# Altium schematic sheet Power Management.SchDoc
size A4; SheetNumber: 2; SheetTotal: 7
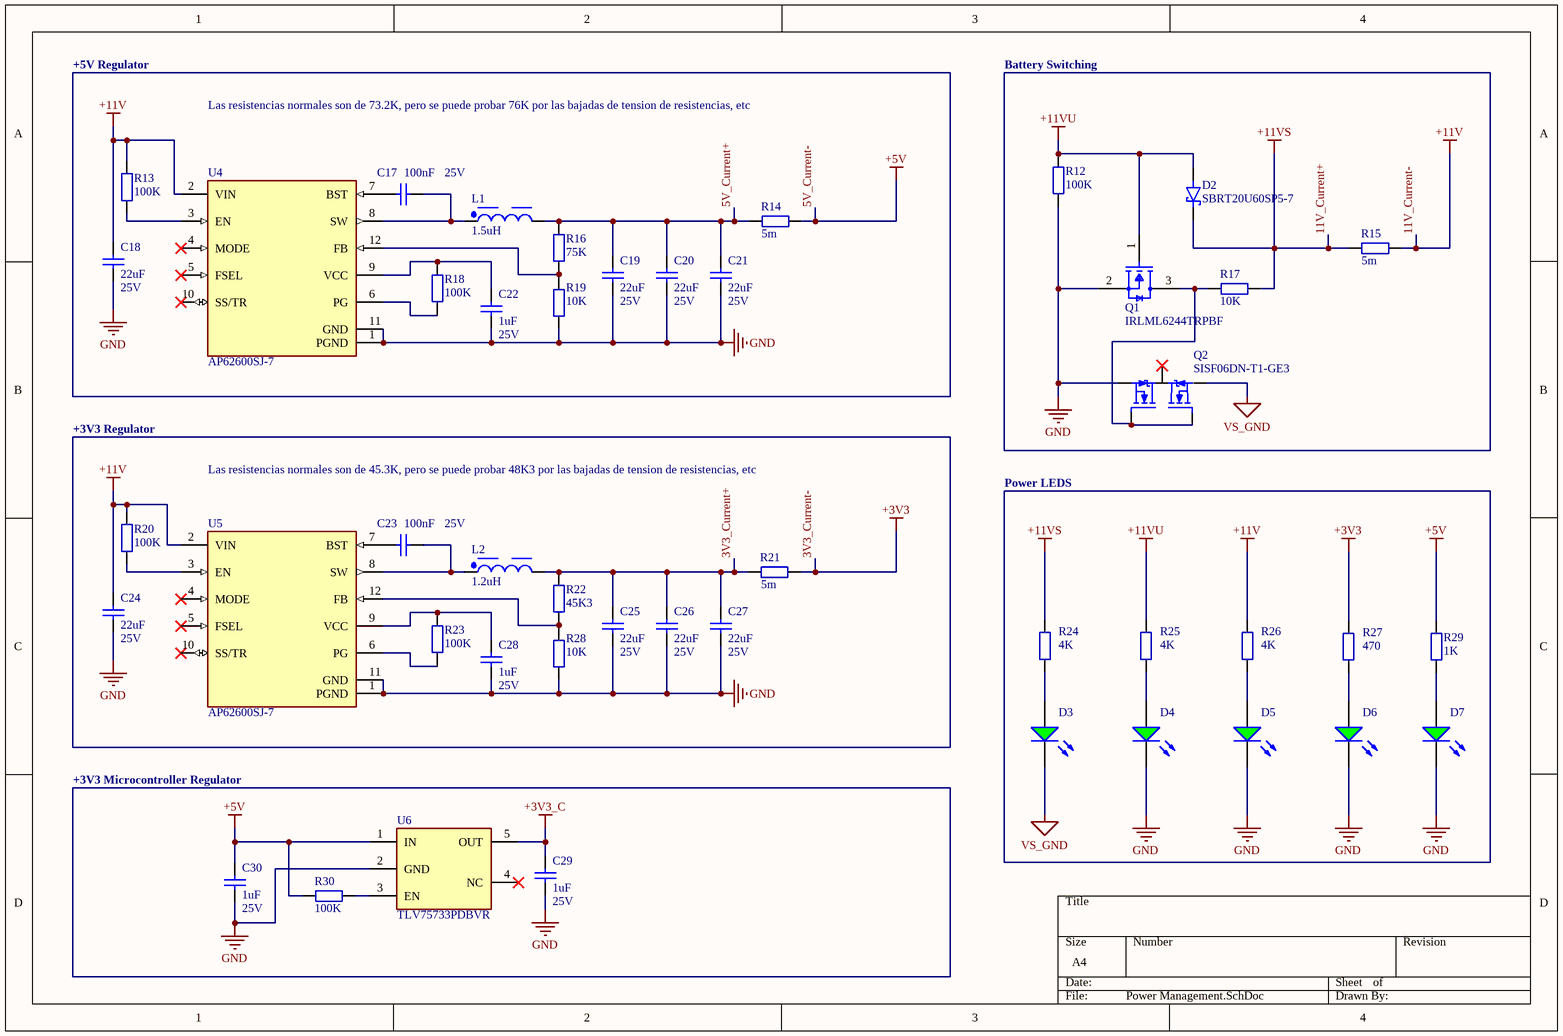
[diagram p0: Power Management.SchDoc]

## Parts
C17  value 100nF  Voltage: 25V  [MY_0603]  (hidden comment: Cap ceramic)
C18  22uF  Voltage: 25V  [MY_0805]
C19  22uF  Voltage: 25V  [MY_0805]
C20  22uF  Voltage: 25V  [MY_0805]
C21  22uF  Voltage: 25V  [MY_0805]
C22  value 1uF  Volte: 25V  [MY_0603]  (hidden comment: Cap ceramic)
C23  value 100nF  Voltage: 25V  [MY_0603]  (hidden comment: Cap ceramic)
C24  22uF  Voltage: 25V  [MY_0805]
C25  22uF  Voltage: 25V  [MY_0805]
C26  22uF  Voltage: 25V  [MY_0805]
C27  22uF  Voltage: 25V  [MY_0805]
C28  value 1uF  Volte: 25V  [MY_0603]  (hidden comment: Cap ceramic)
C29  value 1uF  Volte: 25V  [MY_0603]  (hidden comment: Cap ceramic)
C30  value 1uF  Volte: 25V  [MY_0603]  (hidden comment: Cap ceramic)
D2  SBRT20U60SP5-7  [SBRT20U60SP5-7-Footprint-1]
D3  (no value)  [WL-SMCW_0805_150080xx75000]
D4  (no value)  [WL-SMCW_0805_150080xx75000]
D5  (no value)  [WL-SMCW_0805_150080xx75000]
D6  (no value)  [WL-SMCW_0805_150080xx75000]
D7  (no value)  [WL-SMCW_0805_150080xx75000]
L1  1.5uH  [WE-MAPI_4020]
L2  1.2uH  [WE-MAPI_4020]
Q1  IRLML6244TRPBF  [FP-Micro3-IPC_C]
Q2  SISF06DN-T1-GE3  [SISF06DN-T1-GE3-Footprint-1]
R12  100K  [R0603-0.45]
R13  100K  [R0603-0.45]
R14  5m  [R0612]
R15  5m  [R0612]
R16  75K  [R0603-0.45]
R17  10K  [R0603-0.45]
R18  100K  [R0603-0.45]
R19  10K  [R0603-0.45]
R20  100K  [R0603-0.45]
R21  5m  [R0612]
R22  45K3  [R0603-0.45]
R23  100K  [R0603-0.45]
R24  4K  [R0603-0.45]
R25  4K  [R0603-0.45]
R26  4K  [R0603-0.45]
R27  470  [R0603-0.45]
R28  10K  [R0603-0.45]
R29  1K  [R0603-0.45]
R30  100K  [R0603-0.45]
U4  AP62600SJ-7  [FP-V-QFN2030-12_Type_A-MFG]
U5  AP62600SJ-7  [FP-V-QFN2030-12_Type_A-MFG]
U6  TLV75733PDBVR  [SOT95P280X145-5N]

## Blocks framed on the sheet
+5V Regulator: C17-C22 L1 R13 R14 R16 R18 R19 U4
Battery Switching: D2 Q1 Q2 R12 R15 R17
+3V3 Regulator: C23-C28 L2 R20-R23 R28 U5
Power LEDS: D3-D7 R24-R27 R29
+3V3 Microcontroller Regulator: C29 C30 R30 U6

## Nets
3V3_Current-: R21.2 R27.2  [also labelled +3V3]
5V_Current-: C30.2 R14.2 R29.2 R30.1 U6.1(IN)  [also labelled +5V]
11V_Current+: D2.2 R15.1 R17.2 R24.2  [also labelled +11VS]
11V_Current-: C18.1 C24.1 R13.1 R15.2 R20.1 R26.2 U4.2(VIN) U5.2(VIN)  [also labelled +11V]
+3V3_C: C29.2 U6.5(OUT)
+11VU: D2.1 Q1.1(G) R12.1 R25.2
GND: C18.2 C19.2 C20.2 C21.2 C22.1 C24.2 C25.2 C26.2 C27.2 C28.1 C29.1 C30.1 D4.1(K) D5.1(K) D6.1(K) D7.1(K) Q1.2(S) Q2.4(S1) R12.2 R19.2 R28.2 U4.1(PGND) U4.11(GND) U5.1(PGND) U5.11(GND) U6.2(GND)
VS_GND: D3.1(K) Q2.5(S2)
3V3_Current+: C25.1 C26.1 C27.1 L2.2 R21.1 R22.1
5V_Current+: C19.1 C20.1 C21.1 L1.2 R14.1 R16.1
NetC17_1: C17.1 L1.1 U4.8(SW)
NetC17_2: C17.2 U4.7(BST)
NetC22_2: C22.2 R18.1 U4.9(VCC)
NetC23_1: C23.1 L2.1 U5.8(SW)
NetC23_2: C23.2 U5.7(BST)
NetC28_2: C28.2 R23.1 U5.9(VCC)
NetD3_2: D3.2(A) R24.1
NetD4_2: D4.2(A) R25.1
NetD5_2: D5.2(A) R26.1
NetD6_2: D6.2(A) R27.1
NetD7_2: D7.2(A) R29.1
NetQ1_3: Q1.3(D) Q2.1(G1) Q2.3(G2) R17.1
NetR13_2: R13.2 U4.3(EN)
NetR16_2: R16.2 R19.1 U4.12(FB)
NetR18_2: R18.2 U4.6(PG)
NetR20_2: R20.2 U5.3(EN)
NetR22_2: R22.2 R28.1 U5.12(FB)
NetR23_2: R23.2 U5.6(PG)
NetR30_2: R30.2 U6.3(EN)

Not connected (* = marked no-connect by the designer): Q2 2(D)*; U4 4(MODE)* 5(FSEL)* 10(SS/TR)*; U5 4(MODE)* 5(FSEL)* 10(SS/TR)*; U6 4(NC)*

## Notes on the sheet
- Las resistencias normales son de 73.2K, pero se puede probar 76K por las bajadas de tension de resistencias, etc
- Las resistencias normales son de 45.3K, pero se puede probar 48K3 por las bajadas de tension de resistencias, etc

## Library data of the parts
C17 C23 = CMP-015-000000-1: Capacitor, 100nF, 0603, 25V; Manufacturer: Wurth Elektronik; Manufacturer Part Number: 885012206071
  C17: ClassName: REG5V
  C23: ClassName: REG3V3
C18-C21 C24 = CMP-015-000000-1: Capacitor, 22uF, 0805, 25V; Manufacturer: Samsung; Manufacturer Part Number: CL21A226MAYNNNE; ClassName: REG5V
C22 C28-C30 = CMP-015-000000-1: Capacitor, 1uF, 0603, 25V; Manufacturer: Wurth Elektronik; Manufacturer Part Number: 885012206052
  C22: ClassName: REG5V
  C28: ClassName: REG3V3
C25-C27 = CMP-015-000000-1: None polar capacitor; Manufacturer: Samsung; Manufacturer Part Number: CL21A226MAYNNNE; ClassName: REG5V
D2 = CMP-004-00009-1: Rectifier Diode, 1 Phase, 1 Element, 20A, 60V V(RRM), Silicon; Manufacturer: Diodes Incorporated; Manufacturer Part Number: SBRT20U60SP5-7
D3-D7 = CMP-1426-00007-2: LED, 0805, Green; Manufacturer: Wurth Elektronik; Manufacturer Part Number: 150080GS75000
L1 = CMP-03913-66963831-2: 74438356015 Fixed Ind 1.5UH 5.8A 19 Mohm SMD; Manufacturer: Wurth Elektronik; Manufacturer Part Number: 74438356015; ClassName: REG5V
L2 = CMP-207846-000036-3: FIXED IND 1.2UH 5.8A 18 MOHM SMD; Manufacturer: Wurth Elektronik; Manufacturer Part Number: 74438356012; ClassName: REG3V3
Q1 = CMP-013-00010-1: Power Field-Effect Transistor, 6.3A I(D), 20V, 0.021ohm, 1-Element, N-Channel, Silicon, Metal-oxide Semiconductor FET, TO-236AB; RoHS Compliant: Yes; Max Operating Temperature: 150°C; Pins: 3
Q2 = CMP-013-00009-3: Power Field-Effect Transistor, 101A I(D), 30V, 0.0045ohm, 2-Element, N-Channel, Silicon, Metal-oxide Semiconductor FET; RoHS Compliant: Yes
R12 R13 R18 R20 R23 = R: Resistor, 100K, 0603, 0.1W; Manufacturer: Wurth; Manufacturer Part Number: 560112116004; Power Disipation: 0.1W; ClassName: REG5V
R14 R15 R21 = CMP-009-000000-6: Resistor, 5m, 0612, 2W; Manufacturer: Vishay; Manufacturer Part Number: WFCP06125L000FE66
  R14: ClassName: 5V OPAMP
  R15: ClassName: 11V OPAMP
  R21: ClassName: 3V3 OPAMP
R16 = R: Resistor, 75K, 0603, 0.1W; Manufacturer: Wurth; Manufacturer Part Number: 560112110261; Power Disipation: 0.1W; ClassName: REG5V
R17 R19 R28 = R: Resistor, 10K, 0603, 0.1W; Manufacturer: Wurth; Manufacturer Part Number: 560112116005; Power Disipation: 0.1W; ClassName: 2PyroREG
R22 = R: Resistor, 45.3kK, 0603, 0.1W; Manufacturer: Wurth; Manufacturer Part Number: 560112110243; Power Disipation: 0.1W; ClassName: REG3V3
R24-R26 = CMP-009-000000-3: Resistor, 4K, 0603, 0.1W; Manufacturer: Wurth; Manufacturer Part Number: 560112116093; Power Disipation: 0.1W
R27 = CMP-009-000000-3: Resistor, 470K, 0603, 0.1W; Manufacturer: Wurth; Manufacturer Part Number: 560112116067; Power Disipation: 0.1W
R29 = CMP-009-000000-3: Resistor, 1kK, 0603, 0.1W; Manufacturer: Wurth; Manufacturer Part Number: 560112116014; Power Disipation: 0.1W
R30 = R: Resistor, 75K, 0603, 0.1W; Manufacturer: Wurth; Manufacturer Part Number: 560112116004; Power Disipation: 0.1W; ClassName: REG5V
U4 U5 = CMP-012-00004-1: Switching Regulator, 1200kHz Switching Freq-Max; Manufacturer: Diodes Incorporated; Manufacturer Part Number: AP62600SJ-7
  U4: ClassName: REG5V
  U5: ClassName: REG3V3
U6 = CMP-087-000000-3: LDO Voltage Regulators 1A Low-IQ Small-Size Low-Dropout (LDO) Regulator 5-SOT-23 -40 to 125; Manufacturer: Texas Instruments; Manufacturer Part Number: TLV75733PDBVR